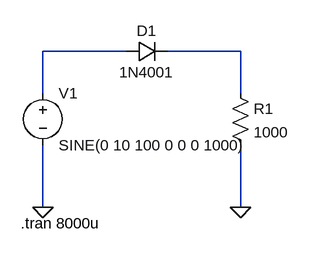
[diagram p0: schematic Half Wave Rectifier.asc]
Half Wave Rectifier.asc, the LTspice schematic file:
Version 4
SHEET 1 880 680
WIRE 336 0 208 0
WIRE 512 0 400 0
WIRE 208 64 208 0
WIRE 512 64 512 0
WIRE 208 240 208 144
WIRE 512 240 512 144
FLAG 208 240 0
FLAG 512 240 0
SYMBOL voltage 208 48 R0
WINDOW 123 0 0 Left 0
WINDOW 39 0 0 Left 0
SYMATTR InstName V1
SYMATTR Value SINE(0 10 100 0 0 0 1000)
SYMBOL diode 336 16 R270
WINDOW 0 32 32 VTop 2
WINDOW 3 0 32 VBottom 2
SYMATTR InstName D1
SYMATTR Value 1N4001
SYMBOL res 496 48 R0
SYMATTR InstName R1
SYMATTR Value 1000
TEXT 174 264 Left 2 !.tran 8000u

The netlist it stands for:
* Half Wave Rectifier.asc
V1 N001 0 SINE(0 10 100 0 0 0 1000)
D1 N001 N002 1N4001
R1 N002 0 1000
.model D D
.lib standard.dio
.tran 8000u
.backanno
.end